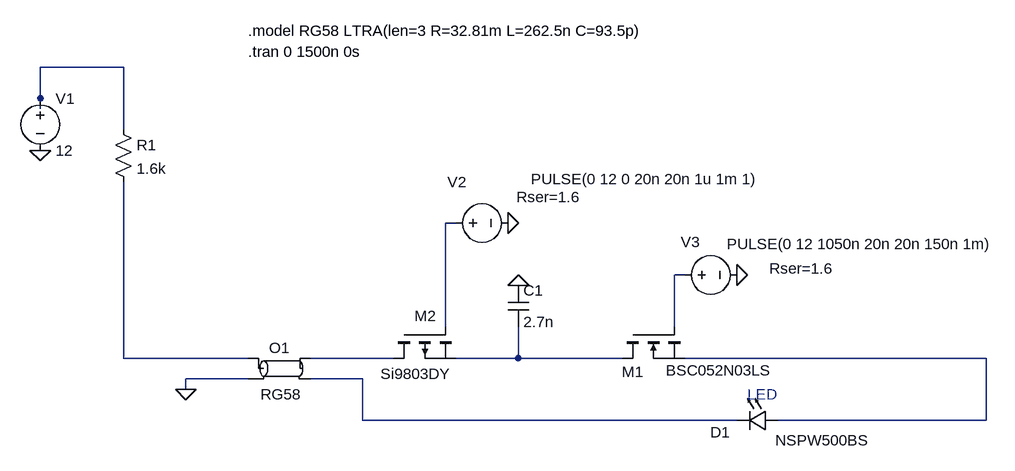
[diagram p0: schematic LEDPulser 2.asc]
LEDPulser 2.asc, the LTspice schematic file:
Version 4
SHEET 1 1780 680
WIRE 32 -272 -96 -272
WIRE -96 -224 -96 -272
WIRE -96 -208 -96 -224
WIRE 32 -176 32 -272
WIRE 544 -32 528 -32
WIRE 896 48 880 48
WIRE 528 128 528 -32
WIRE 880 128 880 48
WIRE 32 176 32 -96
WIRE 224 176 32 176
WIRE 448 176 320 176
WIRE 640 176 640 128
WIRE 640 176 544 176
WIRE 800 176 640 176
WIRE 1360 176 896 176
WIRE 224 208 128 208
WIRE 400 208 320 208
WIRE 128 224 128 208
WIRE 400 272 400 208
WIRE 976 272 400 272
WIRE 1360 272 1360 176
WIRE 1360 272 1040 272
FLAG 128 224 0
FLAG -96 -144 0
FLAG 624 -32 0
FLAG 976 48 0
FLAG 640 64 0
SYMBOL ltline 272 192 R0
WINDOW 3 3 24 Top 2
SYMATTR Value RG58
SYMATTR InstName O1
SYMBOL LED 1040 256 R90
WINDOW 0 50 89 VBottom 2
WINDOW 3 31 -67 VTop 2
SYMATTR InstName D1
SYMATTR Value NSPW500BS
SYMATTR Description Diode
SYMATTR Type diode
SYMBOL voltage -96 -240 R0
WINDOW 123 0 0 Left 0
WINDOW 39 0 0 Left 0
SYMATTR InstName V1
SYMATTR Value 12
SYMBOL voltage 528 -32 R270
WINDOW 123 0 0 Left 0
WINDOW 39 40 208 VLeft 2
WINDOW 0 63 32 VLeft 2
WINDOW 3 68 482 VLeft 2
SYMATTR SpiceLine Rser=1.6
SYMATTR InstName V2
SYMATTR Value PULSE(0 12 0 20n 20n 1u 1m 1)
SYMBOL voltage 880 48 R270
WINDOW 123 0 0 Left 0
WINDOW 39 10 146 VRight 2
WINDOW 0 51 10 VRight 2
WINDOW 3 48 81 VRight 2
SYMATTR SpiceLine Rser=1.6
SYMATTR InstName V3
SYMATTR Value PULSE(0 12 1050n 20n 20n 150n 1m)
SYMBOL cap 624 64 R0
SYMATTR InstName C1
SYMATTR Value 2.7n
SYMATTR SpiceLine V=630 Irms=0 Rser=0 Lser=0
SYMBOL nmos 800 128 M90
WINDOW 0 69 -1 VRight 2
WINDOW 3 67 67 VRight 2
SYMATTR InstName M1
SYMATTR Value BSC052N03LS
SYMBOL pmos 448 128 M90
WINDOW 0 -17 66 VLeft 2
WINDOW 3 72 88 VLeft 2
SYMATTR InstName M2
SYMATTR Value Si9803DY
SYMBOL res 16 -192 R0
SYMATTR InstName R1
SYMATTR Value 1.6k
TEXT 224 -328 Left 2 !.model RG58 LTRA(len=3 R=32.81m L=262.5n C=93.5p)
TEXT 224 -296 Left 2 !.tran 0 1500n 0s
TEXT 992 232 Left 2 ;LED

The netlist it stands for:
* LEDPulser 2.asc
O1 N004 0 N005 N008 RG58
D1 N007 N008 NSPW500BS
V1 N001 0 12
V2 N002 0 PULSE(0 12 0 20n 20n 1u 1m 1) Rser=1.6
V3 N003 0 PULSE(0 12 1050n 20n 20n 150n 1m) Rser=1.6
C1 0 N006 2.7n V=630 Irms=0 Rser=0 Lser=0
M1 N006 N003 N007 N007 BSC052N03LS
M2 N005 N002 N006 N006 Si9803DY
R1 N001 N004 1.6k
.model D D
.lib standard.dio
.model NMOS NMOS
.model PMOS PMOS
.lib standard.mos
.model RG58 LTRA(len=3 R=32.81m L=262.5n C=93.5p)
.tran 0 1500n 0s
* LED
.backanno
.end